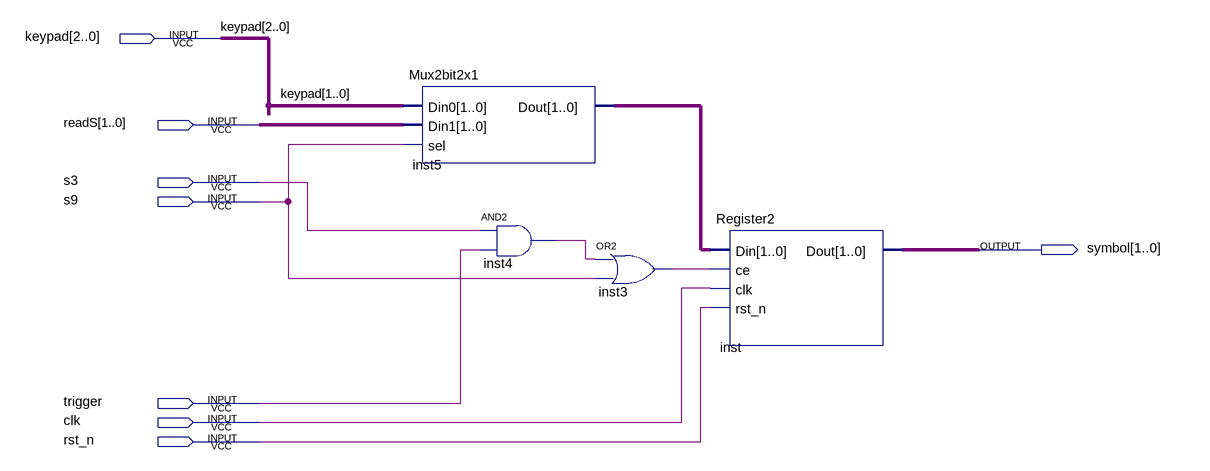
[diagram p0: schematic sheet]
// Quartus schematic SymbolRegister.bdf as structural Verilog: 4 symbols, 8 pins
module SymbolRegister (
  input  [2:0] keypad,
  input  [1:0] readS,
  input  s3,
  input  s9,
  input  trigger,
  input  clk,
  input  rst_n,
  output [1:0] symbol
);

  wire inst3_out, inst4_out;
  wire [1:0] inst5_dout;

  Mux2bit2x1 inst5 (.Din0(keypad[1:0]), .Din1(readS), .sel(s9), .Dout(inst5_dout));
  and inst4 (inst4_out, s3, trigger);
  or inst3 (inst3_out, inst4_out, s9);
  Register2 inst (.Din(inst5_dout), .ce(inst3_out), .clk(clk), .rst_n(rst_n), .Dout(symbol));
endmodule
